# EAGLE schematic ESC_logic (EAGLE 9.0.0)
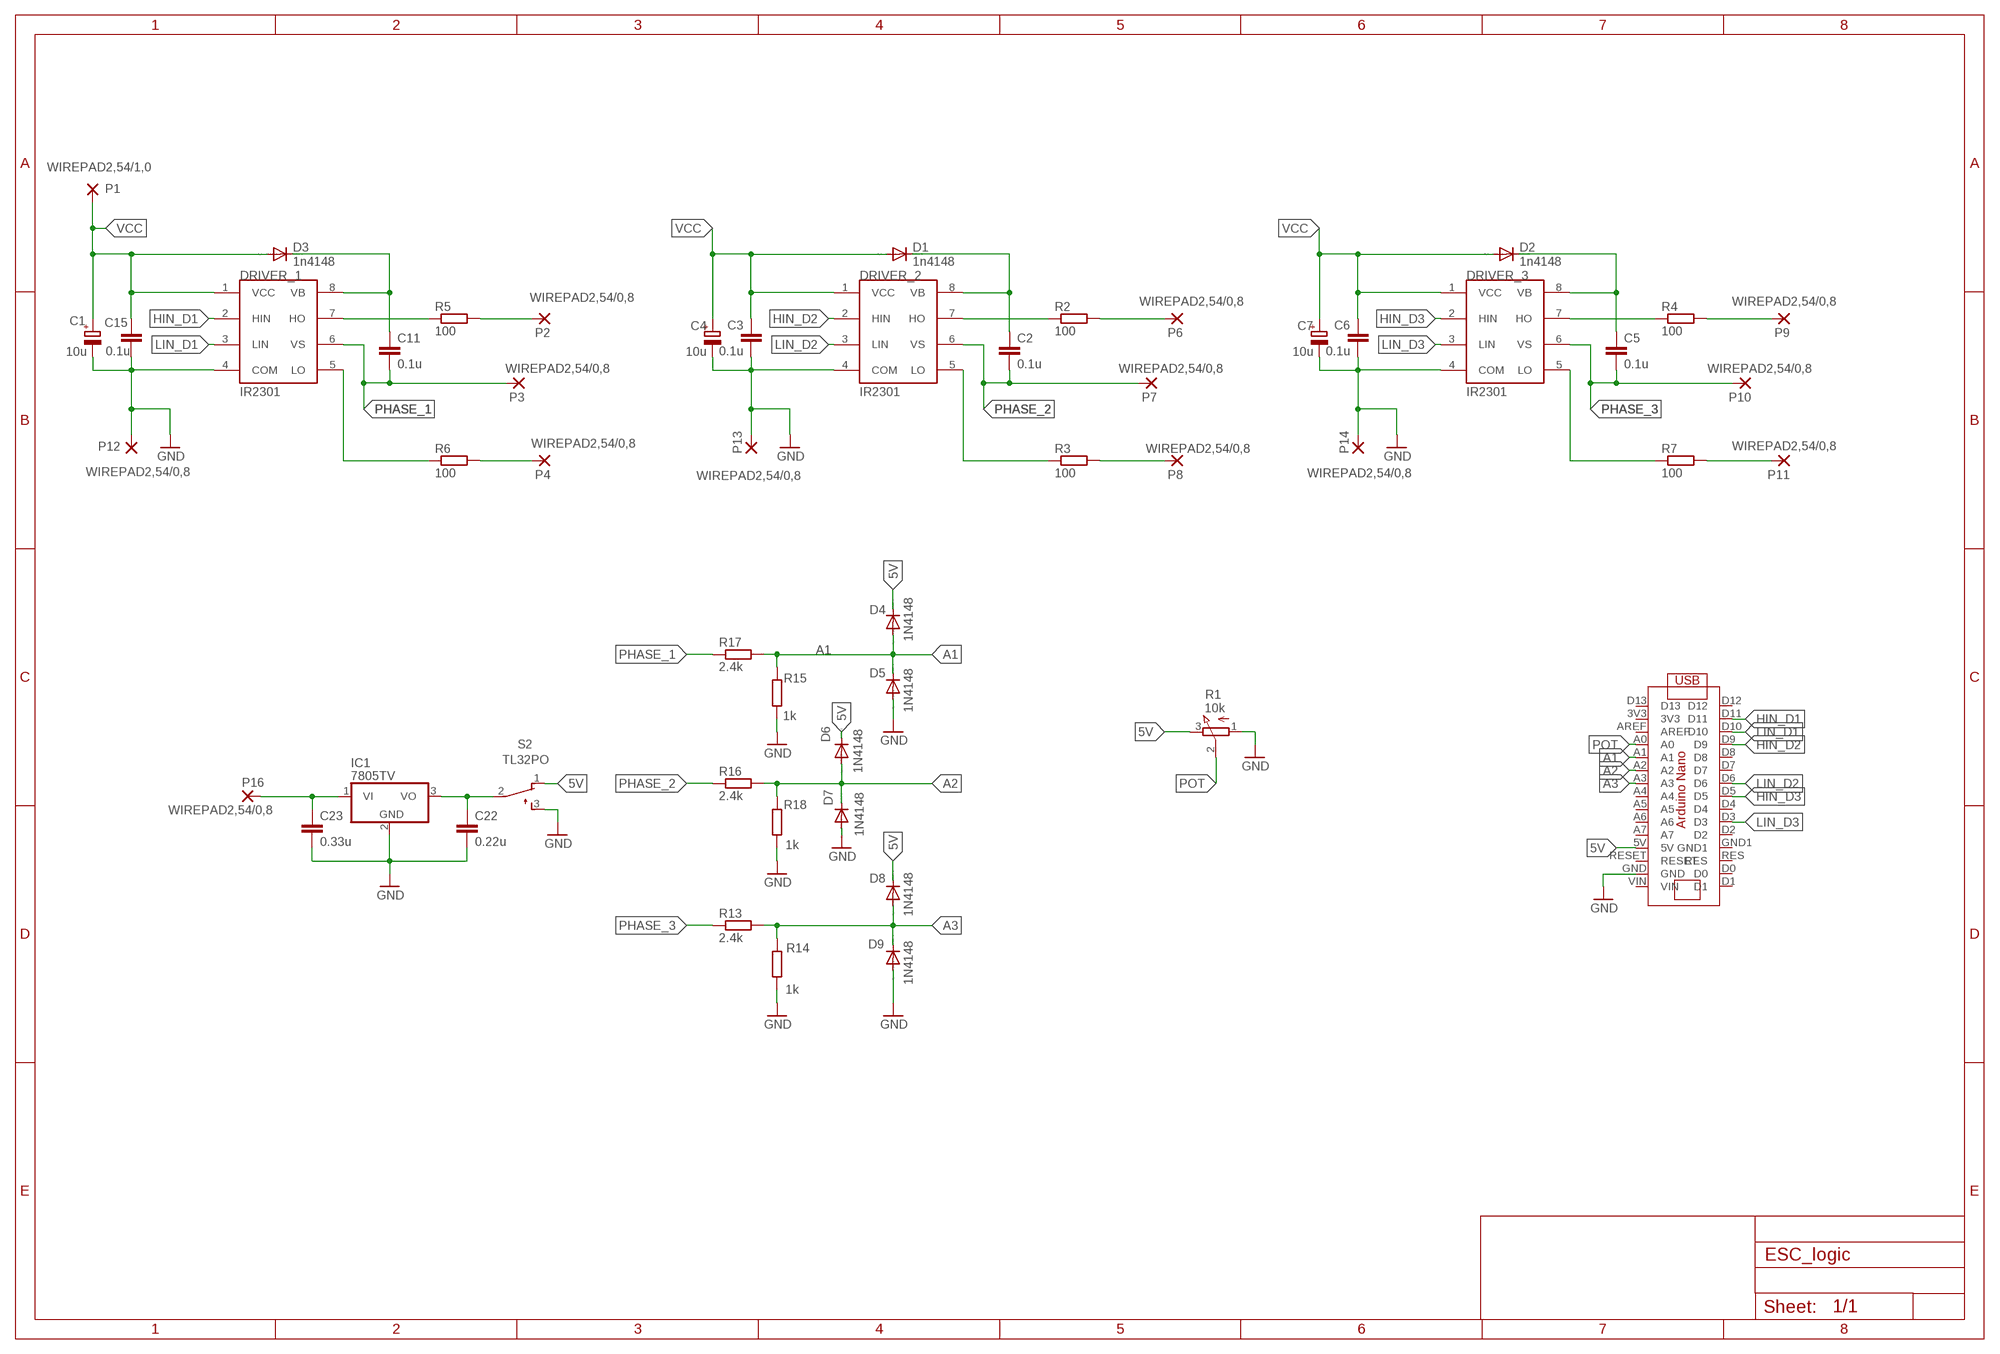
[diagram p0: schematic, sheet 1]

## Parts
C1  10u  CPOL-EU153CLV-0605  [153CLV-0605]
C2  0.1u  CC1206  [C1206]
C3  0.1u  CC1206  [C1206]
C4  10u  CPOL-EU153CLV-0605  [153CLV-0605]
C5  0.1u  CC1206  [C1206]
C6  0.1u  CC1206  [C1206]
C7  10u  CPOL-EU153CLV-0605  [153CLV-0605]
C11  0.1u  CC1206  [C1206]
C15  0.1u  CC1206  [C1206]
C22  0.22u  CC1206  [C1206]
C23  0.33u  CC1206  [C1206]
D1  1n4148  DIODE-DO41-10  [DO41-10]
D2  1n4148  DIODE-DO41-10  [DO41-10]
D3  1n4148  DIODE-DO41-10  [DO41-10]
D4  1N4148  DIODE-DO41-10  [DO41-10]
D5  1N4148  DIODE-DO41-10  [DO41-10]
D6  1N4148  DIODE-DO41-10  [DO41-10]
D7  1N4148  DIODE-DO41-10  [DO41-10]
D8  1N4148  DIODE-DO41-10  [DO41-10]
D9  1N4148  DIODE-DO41-10  [DO41-10]
DRIVER_1  IR2301  [DIL08]
DRIVER_2  IR2301  [DIL08]
DRIVER_3  IR2301  [DIL08]
IC1  7805TV  [TO220V]
P1  WIREPAD2,54/1,0  [2,54/1,0]
P2  WIREPAD2,54/0,8  [2,54/0,8]
P3  WIREPAD2,54/0,8  [2,54/0,8]
P4  WIREPAD2,54/0,8  [2,54/0,8]
P6  WIREPAD2,54/0,8  [2,54/0,8]
P7  WIREPAD2,54/0,8  [2,54/0,8]
P8  WIREPAD2,54/0,8  [2,54/0,8]
P9  WIREPAD2,54/0,8  [2,54/0,8]
P10  WIREPAD2,54/0,8  [2,54/0,8]
P11  WIREPAD2,54/0,8  [2,54/0,8]
P12  WIREPAD2,54/0,8  [2,54/0,8]
P13  WIREPAD2,54/0,8  [2,54/0,8]
P14  WIREPAD2,54/0,8  [2,54/0,8]
P16  WIREPAD2,54/0,8  [2,54/0,8]
R1  10k  3RP/1610N  [3RP/1610N]
R2  100  R-EU_R1206  [R1206]
R3  100  R-EU_R1206  [R1206]
R4  100  R-EU_R1206  [R1206]
R5  100  R-EU_R1206  [R1206]
R6  100  R-EU_R1206  [R1206]
R7  100  R-EU_R1206  [R1206]
R13  2.4k  R-EU_R1206  [R1206]
R14  1k  R-EU_R1206  [R1206]
R15  1k  R-EU_R1206  [R1206]
R16  2.4k  R-EU_R1206  [R1206]
R17  2.4k  R-EU_R1206  [R1206]
R18  1k  R-EU_R1206  [R1206]
S2  TL32PO  [TL3XPO]
U$7  ARDUINO-NANO  [ARDUINO-NANO]

## Nets
5V: D4.C D6.C D8.C R1.3(E) S2.1(O) U$7.5V
A1: D4.A D5.C R15.2 R17.2 U$7.A1
A2: D6.A D7.C R16.2 R18.2 U$7.A2
A3: D8.A D9.C R13.2 R14.2 U$7.A3
GND: C1.- C3.2 C4.- C6.2 C7.- C15.2 C22.2 C23.2 D5.A D7.A D9.A DRIVER_1.4(COM) DRIVER_2.4(COM) DRIVER_3.4(COM) IC1.2(GND) P12.1(P) P13.1(P) P14.1(P) R1.1(A) R14.1 R15.1 R18.1 S2.3(S) U$7.GND
HIN_D1: DRIVER_1.2(HIN) U$7.D11
HIN_D2: DRIVER_2.2(HIN) U$7.D9
HIN_D3: DRIVER_3.2(HIN) U$7.D5
LIN_D1: DRIVER_1.3(LIN) U$7.D10
LIN_D2: DRIVER_2.3(LIN) U$7.D6
LIN_D3: DRIVER_3.3(LIN) U$7.D3
N$1: DRIVER_2.7(HO) R2.1
N$2: DRIVER_2.5(LO) R3.1
N$3: P6.1(P) R2.2
N$4: P8.1(P) R3.2
N$5: DRIVER_3.7(HO) R4.1
N$6: DRIVER_3.5(LO) R7.1
N$7: P9.1(P) R4.2
N$8: P11.1(P) R7.2
N$15: DRIVER_1.7(HO) R5.1
N$18: DRIVER_1.5(LO) R6.1
N$19: P2.1(P) R5.2
N$20: P4.1(P) R6.2
PHASE_1: C11.2 DRIVER_1.6(VS) P3.1(P) R17.1
PHASE_2: C2.2 DRIVER_2.6(VS) P7.1(P) R16.1
PHASE_3: C5.2 DRIVER_3.6(VS) P10.1(P) R13.1
POT: R1.2(S) U$7.A0
VB: C11.1 D3.C DRIVER_1.8(VB)
VB2: C2.1 D1.C DRIVER_2.8(VB)
VB3: C5.1 D2.C DRIVER_3.8(VB)
VCC: C1.+ C3.1 C4.+ C6.1 C7.+ C15.1 D1.A D2.A D3.A DRIVER_1.1(VCC) DRIVER_2.1(VCC) DRIVER_3.1(VCC) P1.1(P)
VI: C23.1 IC1.1(VI) P16.1(P)
VO: C22.1 IC1.3(VO) S2.2(P)
Unconnected: U$7.3V3 U$7.A4 U$7.A5 U$7.A6 U$7.A7 U$7.AREF U$7.D0 U$7.D1 U$7.D2 U$7.D4 U$7.D7 U$7.D8 U$7.D12 U$7.D13 U$7.GND1 U$7.RES U$7.RESET U$7.VIN

## Library data of the parts
C1 C4 C7 = resistor:CPOL-EU: POLARIZED CAPACITOR, European symbol
C2 C3 C5 C6 C11 C15 C22 C23 = Kondensator.:C: KONDENSATOR
D1-D9 = diode:DIODE-: DIODE
DRIVER_1-DRIVER_3 = kirill:IR2301: High and low side driver; AVAILABILITY: Unavailable; DESCRIPTION: High and Low Side Driver, Noninverting Inputs; MF: Infineon; MP: IR2301; PACKAGE: DIP-8 International Rectifier; PRICE: None
IC1 = linear:78*: Positive VOLTAGE REGULATOR Source: http://cache.national.com/ds/LM/LM78L05.pdf http://www.fairchildsemi.com/ds/LM/LM7805.pdf
P1-P4 P6-P14 P16 = wirepad:WIREPAD: Wire PAD connect wire on PCB
R1 = pot:3RP/1610N: 16mm Potentiometer one level Source: http://www.alphapotentiometers.net/html/16mm_pot_2.html
R2-R7 R13-R18 = Widerstände:R-EU_: RESISTOR; SPICEPREFIX: R
S2 = switch:TL32PO: TINY SWITCH ON - MOM Source: http://www2.produktinfo.conrad.com/datenblaetter/700000-724999/705152-da-01-de-Subminiaturschalter_TL_36YO.pdf
U$7 = Arduino-nano:ARDUINO-NANO